# EAGLE design untitled (EAGLE 9.3.0)
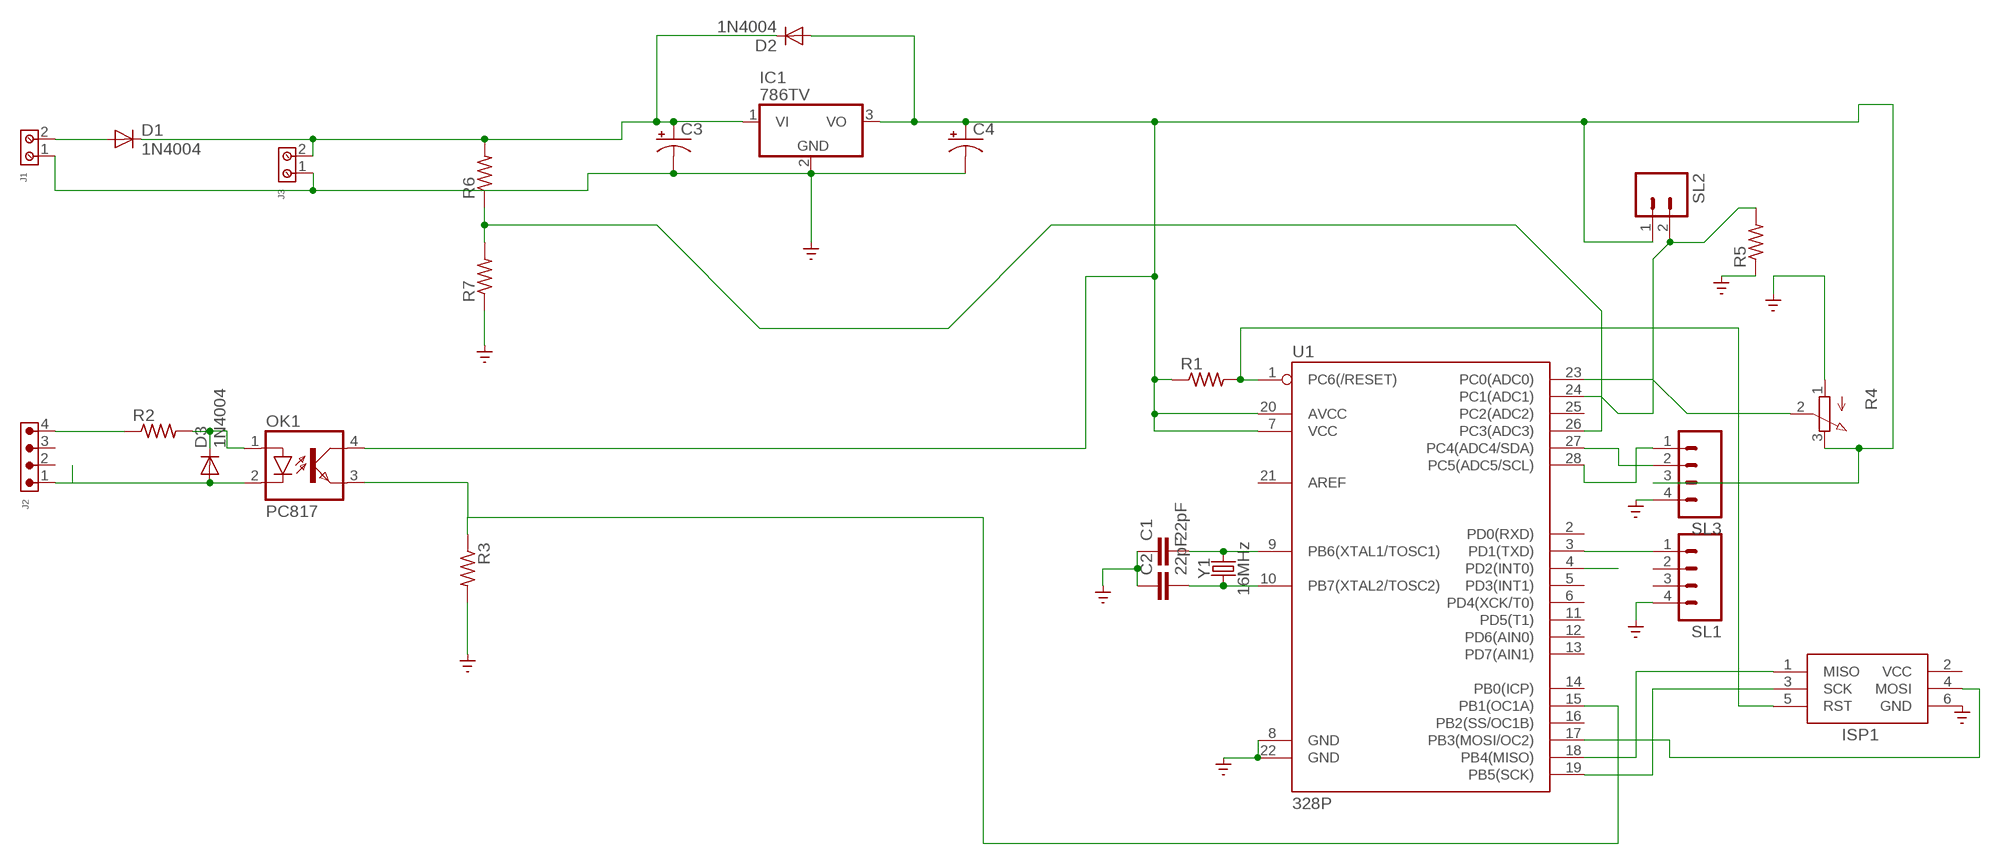
[diagram p0: schematic, sheet 1]

## Parts
C1  22pF  22PF-PTH-2.54MM-200V-5%  [CAP-PTH-2.54]
C2  22pF  22PF-PTH-2.54MM-200V-5%  [CAP-PTH-2.54]
C3  CAPACITOR-PE5-10.5  [E5-10,5]
C4  CAPACITOR-PE5-6  [E5-6]
D1  1N4004  [DO41-10]
D2  1N4004  [DO41-10]
D3  1N4004  [DO41-10]
IC1  786TV  [TO220V]
ISP1  AVRISP-6  [AVRISP]
J1  691213710002  [691213710002]
J2  691305530004  [691305530004]
J3  691213710002  [691213710002]
OK1  PC817  [DIL04]
R1  R-US_0207/9  [0207/9]
R2  R-US_0207/9  [0207/9]
R3  R-US_0207/9  [0207/9]
R4  3RP/1610N  [3RP/1610N]
R5  R-US_0207/9  [0207/9]
R6  R-US_0207/9  [0207/9]
R7  R-US_0207/9  [0207/9]
SL1  M04  [04P]
SL2  M02  [02P]
SL3  M04  [04P]
U1  328P  ATMEGA328P_PDIP  [DIP28]
Y1  16MHz  CRYSTAL-16MHZPTH-HC49US  [HC49US]

## Nets
GND: C1.1 C2.1 C3.- C4.- IC1.2(GND) ISP1.6(GND) J1.1 J3.1 R3.2 R4.1(A) R5.1 R7.1 SL1.4 SL3.4 U1.8(GND) U1.22(GND) ; supply symbol labelled SUPPLY_BRASTAN_GND_
N$1: D1.A J1.2
N$2: C3.+ D1.C D2.C IC1.1(VI) J3.2 R6.2
N$3: C1.2 U1.9(PB6(XTAL1/TOSC1)) Y1.2
N$4: ISP1.5(RST) R1.2 U1.1(PC6(/RESET))
N$5: ISP1.1(MISO) U1.18(PB4(MISO))
N$6: C4.+ D2.A IC1.3(VO) OK1.4(COL) R1.1 R4.3(E) SL2.1 SL3.3 U1.7(VCC) U1.20(AVCC)
N$7: C2.2 U1.10(PB7(XTAL2/TOSC2)) Y1.1
N$8: ISP1.3(SCK) U1.19(PB5(SCK))
N$9: ISP1.4(MOSI) U1.17(PB3(MOSI/OC2))
N$10: SL1.1 U1.3(PD1(TXD))
N$11: D3.A J2.1 OK1.2(C)
N$12: J2.4 R2.1
N$13: D3.C OK1.1(A) R2.2
N$14: U1.4(PD2(INT0))
N$15: OK1.3(EMIT) R3.1 U1.15(PB1(OC1A))
N$16: R6.1 R7.2 U1.26(PC3(ADC3))
N$17: R4.2(S) U1.23(PC0(ADC0))
N$18: R5.2 SL2.2 U1.24(PC1(ADC1))
N$22: SL3.2 U1.27(PC4(ADC4/SDA))
N$23: SL3.1 U1.28(PC5(ADC5/SCL))
Unconnected: J2.2 J2.3 SL1.2 SL1.3 U1.2(PD0(RXD)) U1.5(PD3(INT1)) U1.6(PD4(XCK/T0)) U1.11(PD5(T1)) U1.12(PD6(AIN0)) U1.13(PD7(AIN1)) U1.14(PB0(ICP)) U1.16(PB2(SS/OC1B)) U1.21(AREF) U1.25(PC2(ADC2))

## Power pins joined to a net without a drawn wire
VCC: ISP1.2(VCC)

## Library data of the parts
C1 C2 = SparkFun-Capacitors:22PF: 22pF ceramic capacitors A capacitor is a passive two-terminal electrical component used to store electrical energy temporarily in an electric field.; PROD_ID: CAP-09128
C3 C4 = BeagleBone_Blue_R3:CAPACITOR-P: POLARIZED CAPACITOR, American symbol
D1-D3 = adafruit:1N4004: DIODE General purpose 1N400x type rectifier (With bigger pads) http://www.ladyada.net/library/pcb/eaglelibrary.html
IC1 = linear:78*: Positive VOLTAGE REGULATOR Source: http://cache.national.com/ds/LM/LM78L05.pdf http://www.fairchildsemi.com/ds/LM/LM7805.pdf
ISP1 = adafruit:AVRISP: AVR ISP HEADER Standard 6 pin header for AVR programming
J1 J3 = Wurth_Connectors_WR-TBL Rising Cage Clamp:691213710002: WR-TBL Serie 213 - 5.00 mm Horiz.l Entry Modular KIND PROPERTIES Pitch 5 mm MATERIAL PROPERTIES Insulator Material PA66 Insulator Flammability Rating UL94 V-0 Insulator Color Green Contact Material Brass Contact Plating Copper over Zinc Terminal Screw Material Steel Terminal Screw Plating Zinc Wire Guard Material Brass GENERAL INFORMATION Operating Temperature -40 up to +105 °C Compliance Lead free / RoHS ELECTRICAL PROPERTIES IR UL 10 A IR VDE 10 A Working Voltage [UL] 300 V (AC) Working Voltage [VDE] 250 V (AC) Withstanding Voltage [UL] 1600 V (AC) Withstanding Voltage [cULus] 1600 V (AC) Withstanding Voltage [VDE] 2000 V (AC) Contact Resistance [UL] 20 mΩ Contact Resistance [cULus] 20 mΩ Contact Resistance [VDE] 20 mΩ MECHANICAL PROPERTIES Wire Strip Length 5 up to 6 (mm) Screw M2.5 CERTIFICATION UL Approval E315414 VDE Approval 40024437 VDE Approval 40024437 PACKAGING PROPERTIES Packaging Box <https://www.we-online.com/catalog/media/o33234v209%20Family_WR-TBL_69121371000x.jpg> Details see: https://www.we-online.com/catalog/en/TBL_5_00_213_HORIZONTAL_ENTRY_MODULAR_69121371000X/ Updated by Ella Wu 2019-11-22 2019(C) Wurth Elektronik; DATASHEET-URL: https://www.we-online.com/catalog/datasheet/691213710002.pdf; IR-UL: 10A; IR-VDE: 10A; MOUNT: THT; PART-NUMBER: 691213710002; PINS: 2; PITCH: 5mm; TYPE: Horizontal; WIRE: 26 to 16 (AWG) 0.129 to 1.31 (mm²); WORKING-VOLTAGE-UL: 300V (AC); WORKING-VOLTAGE-VDE: 250V (AC)
J2 = Wurth_Connectors_WR-TBL Pluggable Connector:691305530004: WR-TBL Serie 3055 - 5,08 mm - PCB Header Vertical Entry with Plastic Latches KIND PROPERTIES Pitch 5.08 mm MATERIAL PROPERTIES Insulator Material PA66 Insulator Flammability Rating UL94 V-0 Insulator Color Green Terminal Material Copper Alloy Terminal Plating Tin-plated surface GENERAL INFORMATION Operating Temperature -40 up to +105 °C ELECTRICAL PROPERTIES IR UL 16 A Working Voltage [UL] 300 V (AC) Withstanding Voltage [UL] 2500 V (AC) Contact Resistance [UL] 20 mΩ CERTIFICATION UL Approval E315414 <https://www.we-online.com/catalog/media/o135349v209%20Family_WR-TBL3_6913055300xx.jpg> Details see: https://www.we-online.com/catalog/en/TBL_5_08_3055_6913055300XX/ Updated by Ella Wu 2019-12-30 2019(C) Wurth Elektronik; DATASHEET-URL: https://www.we-online.com/catalog/datasheet/691305530004.pdf; IR-UL: 16A; MOUNT: THT; PART-NUMBER: 691305530004; PINS: 4; PITCH: 5.08mm; TYPE: Vertical; WORKING-VOLTAGE-UL: 300V (AC)
OK1 = optocoupler:PC817: SHARP OPTO COUPLER; MPN: PC817X4J000F; OC_FARNELL: 9707727; OC_NEWARK: 97K7059
R1-R3 R5-R7 = adafruit:R-US_: RESISTOR, American symbol
R4 = pot:3RP/1610N: 16mm Potentiometer one level Source: http://www.alphapotentiometers.net/html/16mm_pot_2.html
SL1 SL3 = con-amp-quick:M04: AMP QUICK CONNECTOR; OC_FARNELL: unknown; OC_NEWARK: unknown
SL2 = con-amp-quick:M02: AMP QUICK CONNECTOR; OC_FARNELL: unknown; OC_NEWARK: unknown
U1 = SparkFun-IC-Microcontroller:ATMEGA328P_PDIP: Atmel 328P Through hole ATMEGA328P uC used in the Arduino 32kb flash, 1k EEPROM, 2k SRAM Datasheet <http://www.sparkfun.com/datasheets/Components/SMD/ATMega328.pdf> SparkFun Products Storefront component: AVR 28 Pin 20MHz 32K 6A/D - ATMega328P <https://www.sparkfun.com/products/9061> (COM-09061) SparkFun Simon Says - Through-Hole Soldering Kit <https://www.sparkfun.com/products/10547> (KIT-10547) SparkFun Learn to Solder - Simon Says <https://www.sparkfun.com/products/13708> (KIT-13708) SparkFun BigTime Watch Kit <https://www.sparkfun.com/products/11734> (KIT-11734) SparkFun ClockIt <https://www.sparkfun.com/products/10930> (KIT-10930) SparkFun Serial Enabled LCD Kit <https://www.sparkfun.com/products/10097> (LCD-10097) SparkFun Simon Tilts - Through Hole Soldering Kit <https://www.sparkfun.com/products/12634> (KIT-12634) SparkFun Frequency Counter Kit <https://www.sparkfun.com/products/10140> (KIT-10140) FabFM Radio Kit <https://www.sparkfun.com/products/11043> (KIT-11043) SparkFun Binary Blaster Kit <https://www.sparkfun.com/products/12037> (KIT-12037) SparkFun Metro-Gnome <https://www.sparkfun.com/products/9236> (KIT-09236) ATmega328 with Arduino Optiboot (Uno) <https://www.sparkfun.com/products/10524> (DEV-10524); PROD_ID: IC-09136
Y1 = SparkFun-Clocks:CRYSTAL-16MHZ: 16MHz Crystal Digikey Example <http://www.digikey.com/product-search/en?keywords=535-9122-1-ND> Frequency: 16MHz Frequency Stability: ±50ppm Frequency Tolerance: ±20ppm Load Capacitance: 18pF SparkFun Products: Pro Micro -5V/16MHz <https://www.sparkfun.com/products/12640> SparkFun Serial Enabled LCD Kit <https://www.sparkfun.com/products/10097>; PROD_ID: XTAL-08181; SF_ID: COM-00536

## Board
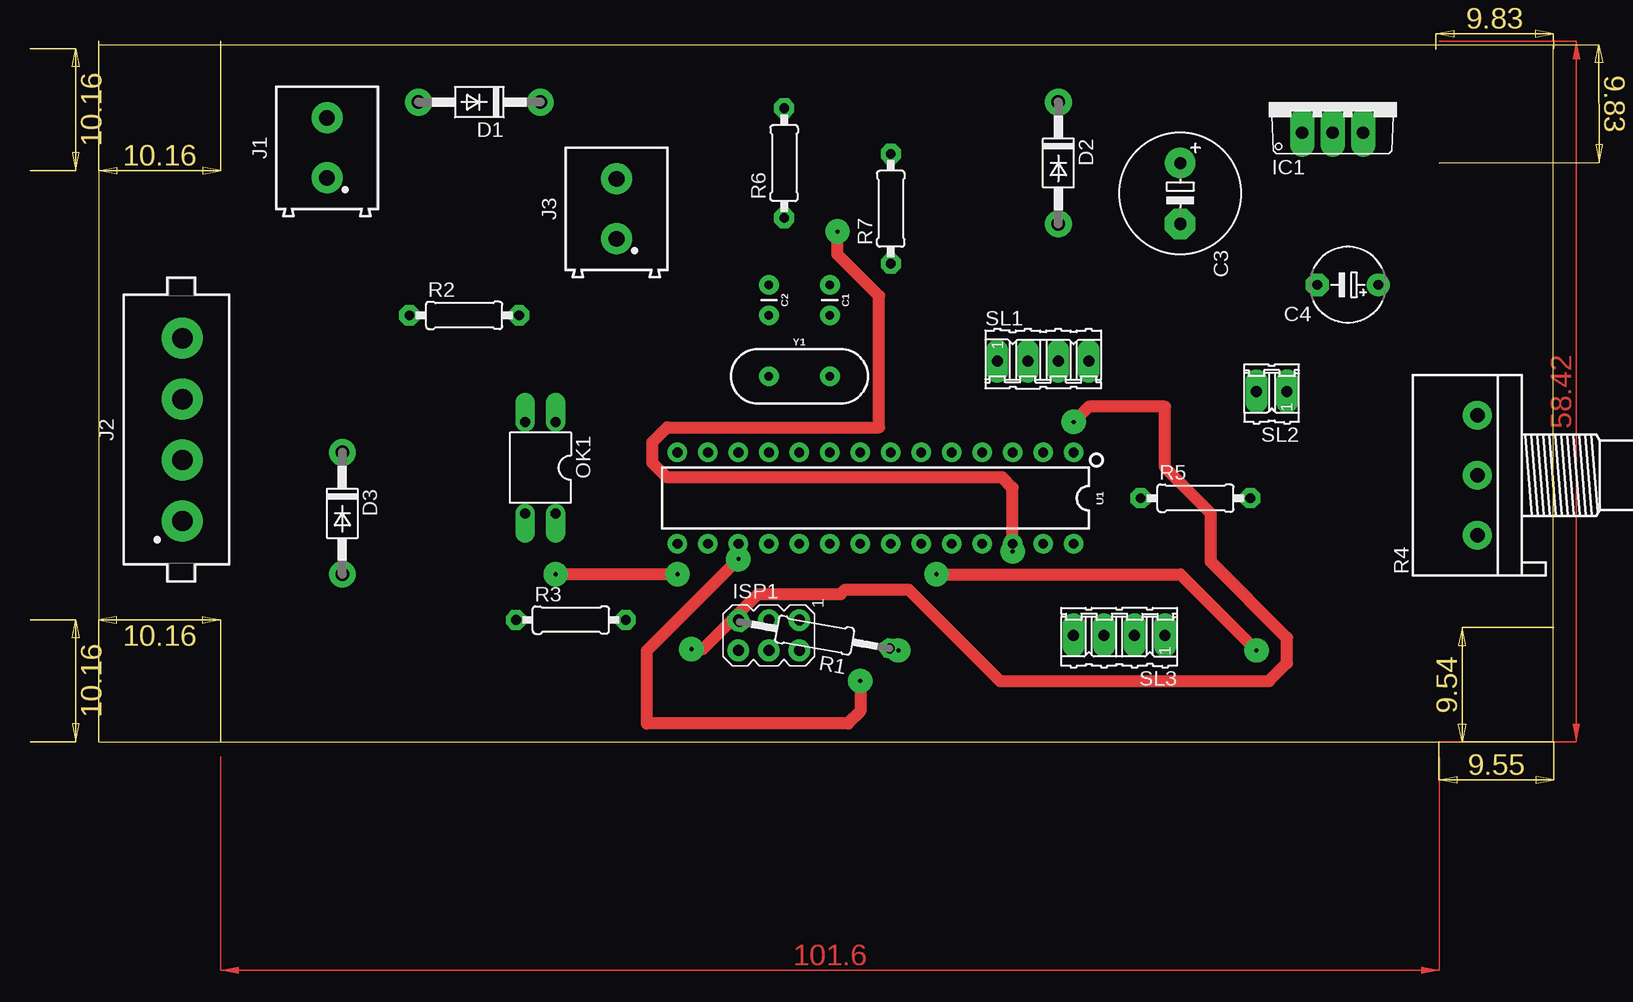
[diagram p1: board, top side]
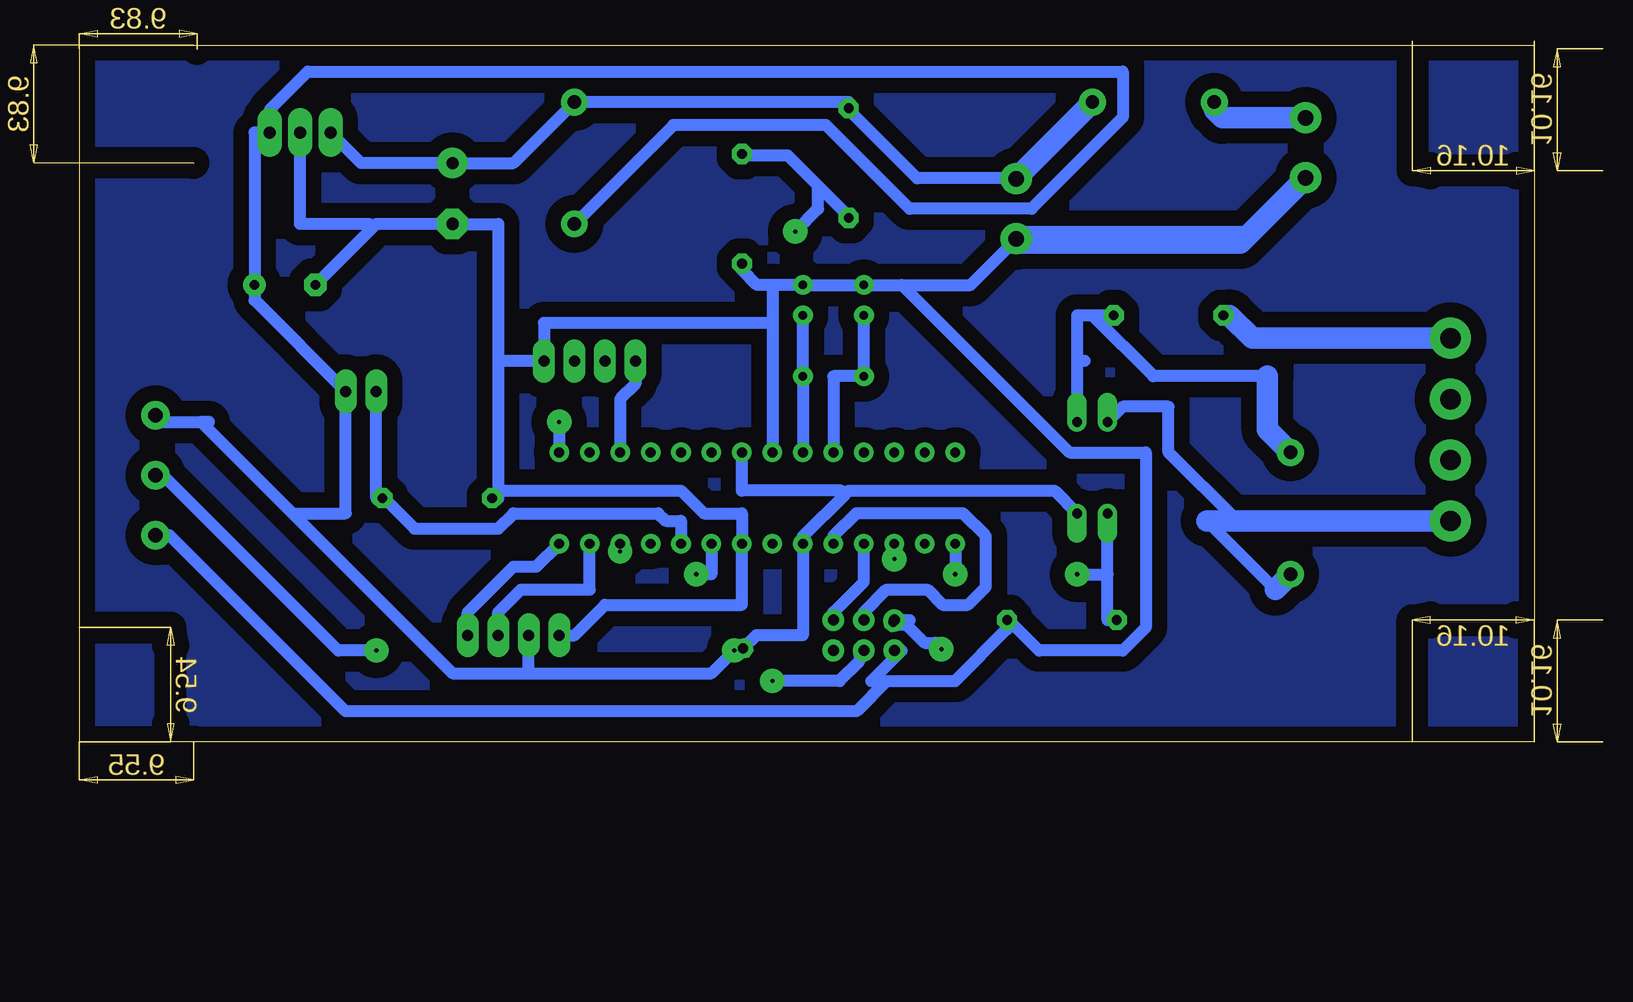
[diagram p2: board, bottom side, seen from below]

Size 121.27 x 58.09 mm. Coordinates in mm from the lower left corner, seen from the top.
Outline: 0,0 121.27,0 121.27,58.09 0,58.09 0,0
Copper layers (1*16): Top 0.035mm / dielectric 1.5mm / Bottom 0.035mm
Design rules "default *": minimum track width 40mil, minimum drill 0.35mm, track to track 30mil, track to pad 30mil, pad to pad 6mil, via to via 6mil, smd to smd 6mil, copper to edge 40mil, drill to drill 6mil, minimum pad ring 10mil, minimum via ring 8mil, stop-mask expansion 4mil, vias tented up to drill 0mil, thermal gap 10mil

### Footprints (pad centres in the part's own frame; a part is rotated, then mirrored left to right if it is on the bottom)
CAP-PTH-2.54 = drill 0.7 pad 1.651: 1 -1.27,0; 2 1.27,0
E5-10,5 = drill 1.016 pad 2.54: + -2.54,0 | drill 1.016 pad 2.54 octagon: - 2.54,0
E5-6 = drill 0.813 pad 1.905: + -2.54,0 | drill 0.813 pad 1.905 octagon: - 2.54,0
DO41-10 = drill 1.118 pad 1.93: A 5.08,0; C -5.08,0
TO220V = drill 1.016 long: 1 -2.54,-2.54; 2 0,-2.54; 3 2.54,-2.54
AVRISP = drill 0.9 pad 1.626: 1 -1.27,2.54; 2 1.27,2.54; 3 -1.27,0; 4 1.27,0; 5 -1.27,-2.54; 6 1.27,-2.54
691213710002 = drill 1.3: 1 -2.5,0; 2 2.5,0
691305530004 = drill 1.7: 1 -7.62,0; 2 -2.54,0; 3 2.54,0; 4 7.62,0
DIL04 = drill 0.813 offset: 1 -1.27,-3.81; 2 1.27,-3.81; 3 1.27,3.81; 4 -1.27,3.81
0207/12 = drill 0.813 octagon: 1 -6.35,0; 2 6.35,0
0207/9 = drill 0.813 pad 1.676 octagon: 1 -4.572,0; 2 4.572,0
3RP/1610N = drill 1.2 pad 2.184: 1 -5,0; 2 0,0; 3 5,0
04P = drill 0.914 long: 1 -3.81,0; 2 -1.27,0; 3 1.27,0; 4 3.81,0
02P = drill 0.914 long: 1 -1.27,0; 2 1.27,0
DIP28 = drill 0.813 pad 1.626: 1 -16.51,-3.81; 2 -13.97,-3.81; 3 -11.43,-3.81; 4 -8.89,-3.81; 5 -6.35,-3.81; 6 -3.81,-3.81; 7 -1.27,-3.81; 8 1.27,-3.81; 9 3.81,-3.81; 10 6.35,-3.81; 11 8.89,-3.81; 12 11.43,-3.81; 13 13.97,-3.81; 14 16.51,-3.81; 15 16.51,3.81; 16 13.97,3.81; 17 11.43,3.81; 18 8.89,3.81; 19 6.35,3.81; 20 3.81,3.81; 21 1.27,3.81; 22 -1.27,3.81; 23 -3.81,3.81; 24 -6.35,3.81; 25 -8.89,3.81; 26 -11.43,3.81; 27 -13.97,3.81; 28 -16.51,3.81
HC49US = drill 0.7 pad 1.651: 1 -2.54,0; 2 2.54,0

### Placement (x,y rotation side)
C1  60.96,36.83 270 top
C2  55.88,36.83 270 top
C3  90.17,45.72 270 top
C4  104.14,38.1 180 top
D1  31.75,53.34 180 top
D2  80.01,48.26 270 top
D3  20.32,19.05 270 top
IC1  102.87,53.34 0 top
ISP1  55.88,8.89 270 top
J1  19.05,49.53 90 top
J2  6.99,26.04 90 top
J3  43.18,44.45 90 top
OK1  36.83,22.86 180 top
R1  [0207/12]  59.69,8.89 170 top
R2  30.48,35.56 0 top
R3  39.37,10.16 0 top
R4  114.94,22.23 90 top
R5  91.44,20.32 0 top
R6  57.15,48.26 90 top
R7  66.04,44.45 90 top
SL1  78.74,31.75 0 top
SL2  97.79,29.21 180 top
SL3  85.09,8.89 180 top
U1  64.77,20.32 180 top
Y1  58.42,30.48 0 top

### Tracks (layer width: path | path; a pad name or v marks a point on that pad's centre or on a via)
GND
  Bottom 1.016: SL3.4 80.01,8.89 77.47,11.43 66.04,11.43 U1.22 66.04,19.05 69.22,19.05 71.12,20.95 86.36,20.95 | 86.36,31.75 86.36,20.95 | 86.36,20.95 86.36,20.32 R5.1 86.36,20.95 | 86.36,31.75 SL1.4 82.55,34.92 63.5,34.92 | 96.84,42.86 96.52,43.18 C3.- 86.36,43.18 86.36,31.75 | 96.84,42.86 C4.- | IC1.2 102.87,43.18 97.16,43.18 96.84,42.86 | ISP1.6 52.7,7.62 55.25,5.08 53.97,5.08 | 53.97,5.08 48.26,5.08 43.94,9.4 R3.2 43.81,10.16 41.27,7.62 34.29,7.62 32.39,9.53 32.39,24.13 38.73,24.13 52.7,38.1 | 53.97,5.08 56.52,2.54 99.06,2.54 113.74,17.23 R4.1 | 63.5,38.1 63.5,34.92 | 63.5,34.92 U1.8 | 63.5,38.1 C1.1 C2.1 52.7,38.1 | 63.5,38.1 64.77,38.1 66.04,39.37 R7.1 | 52.7,38.1 46.99,38.1 43.5,41.59 43.18,41.91 J3.1 43.18,42.55 23.5,42.55 19.05,46.99 J1.1
  Bottom 1.778: J1.1 24.49,41.59 43.5,41.59
N$1
  Bottom 1.778: J1.2 26,52.03 26.67,52.7 D1.A
N$2
  Bottom 1.016: IC1.1 97.79,48.26 C3.+ 85.09,48.26 D2.C 57.15,53.34 R6.2 57.15,52.7 51.44,46.99 43.18,46.99 J3.2
  Bottom 1.778: D1.C 43.18,46.99
N$3
  Bottom 1.016: U1.9 Y1.2 C1.2
N$4  (via drill 0.35 pad 2.03)
  Top 1.016: v49.42,7.73 50.38,7.73 54.98,12.33 61.86,12.33 62.23,12.7 67.53,12.7 75.15,5.08 97.57,5.08 99.06,6.57 99.06,8.67 92.71,15.02 92.71,19.05 88.9,22.86 88.9,27.94 82.55,27.94 v81.28,26.67
  Bottom 1.016: ISP1.5 53.44,10.06 R1.2 | ISP1.5 52.07,10.16 | ISP1.5 52.97,9.79 52.36,9.79 50.83,8.26 49.95,8.26 v49.42,7.73 | v81.28,26.67 U1.1
N$5
  Bottom 1.016: U1.18 55.88,13.34 58.42,10.79 ISP1.1
N$6  (via drill 0.35 pad 2.03)
  Bottom 1.016: OK1.4 40,20.95 57.15,20.95 57.47,20.64 | 57.47,20.64 60.96,17.14 U1.20 60.96,8.89 64.84,8.89 R1.1 66.51,7.79 v66.67,7.62 68.58,5.71 83.82,5.71 | U1.7 66.04,20.95 57.78,20.95 57.47,20.64 | 83.82,5.71 SL3.3 | 110.49,26.67 111.12,26.67 | 103.5,19.05 99.06,19.05 SL2.1 106.68,36.83 C4.+ 106.68,50.8 IC1.3 105.41,52.7 102.23,55.88 34.29,55.88 34.29,52.07 41.91,44.45 52.07,44.45 59.06,51.44 71.75,51.44 D2.A | R4.3 114.38,26.67 111.12,26.67 | 83.82,5.71 90.17,5.71 103.5,19.05 | 111.12,26.67 103.5,19.05
N$7
  Bottom 1.016: U1.10 58.42,30.48 Y1.1 C2.2
N$8
  Bottom 1.016: U1.19 58.42,17.14 56.52,19.05 47.62,19.05 45.72,17.14 45.72,12.92 47.21,11.43 49.31,11.43 50.58,12.7 53.97,12.7 55.88,10.79 ISP1.3
N$9  (via drill 0.35 pad 2.03)
  Top 1.016: v63.5,5.08 63.5,2.54 62.48,1.52 45.72,1.52 45.72,7.62 v53.34,15.24
  Bottom 1.016: ISP1.4 56.25,7.25 56.25,6.72 57.89,5.08 v63.5,5.08 | v53.34,15.24 U1.17
N$10
  Bottom 1.016: U1.3 76.2,28.57 74.93,29.84 SL1.1
N$11
  Bottom 1.016: 21.59,12.7 27.3,18.41 | 24.77,18.41 30.48,24.13 30.48,27.94 34.29,27.94 OK1.2
  Bottom 1.778: J2.1 24.77,18.41 27.3,18.41 | 21.59,12.7 D3.A
N$12
  Bottom 1.016: 25.4,35.56 R2.1
  Bottom 1.778: J2.4 23.5,33.66 25.4,35.56
N$13
  Bottom 1.016: 38.1,31.75 38.1,35.56 36.83,35.56 | 38.1,31.75 OK1.1 | R2.2 36.83,35.56 | 37.47,31.75 38.1,31.75 | 22.23,30.48 31.75,30.48 36.83,35.56
  Bottom 1.778: 22.23,30.48 22.23,26.04 D3.C
N$15  (via drill 0.35 pad 2.03)
  Top 1.016: v48.26,13.97 v38.1,13.97
  Bottom 1.016: 35.56,13.97 35.56,10.16 R3.1 | 35.56,13.97 OK1.3 | U1.15 v48.26,13.97 | v38.1,13.97 35.56,13.97
N$16  (via drill 0.35 pad 2.03)
  Top 1.016: U1.26 76.2,21.18 75.34,22.05 47.4,22.05 46.18,23.27 46.18,24.99 47.4,26.21 65.06,26.21 65.06,37.17 61.59,40.64 v61.59,42.55
  Bottom 1.016: 59.69,46.35 62.23,48.9 66.04,48.9 R7.2 | 59.69,46.35 57.15,43.81 R6.1 | v61.59,42.55 59.69,44.45 59.69,46.35
N$17  (via drill 0.35 pad 2.03)
  Top 1.016: v69.85,13.97 90.17,13.97 v96.52,7.62
  Bottom 1.016: U1.23 68.58,13.97 v69.85,13.97 | v96.52,7.62 99.69,7.62 114.3,22.23 R4.2
N$18
  Bottom 1.016: U1.24 71.12,18.41 72.39,18.41 73.03,19.05 85.09,19.05 86.36,17.78 93.34,17.78 95.88,20.32 R5.2 96.52,20.32 SL2.2
N$22
  Bottom 1.016: U1.27 78.74,12.7 84.45,12.7 86.36,10.79 SL3.2
N$23
  Bottom 1.016: U1.28 83.19,14.61 85.09,14.61 88.9,10.79 SL3.1
S$1  (via drill 0.35 pad 2.03)
  other vias: 76.2,15.88
S$2
  pour Bottom (isolate 1.27): 0,58.42 121.28,58.42 121.28,-0.64 -0.63,-0.64 -0.63,58.42
(copper drawn outside any net)
  shapes: Bottom circle x2, Top area x2